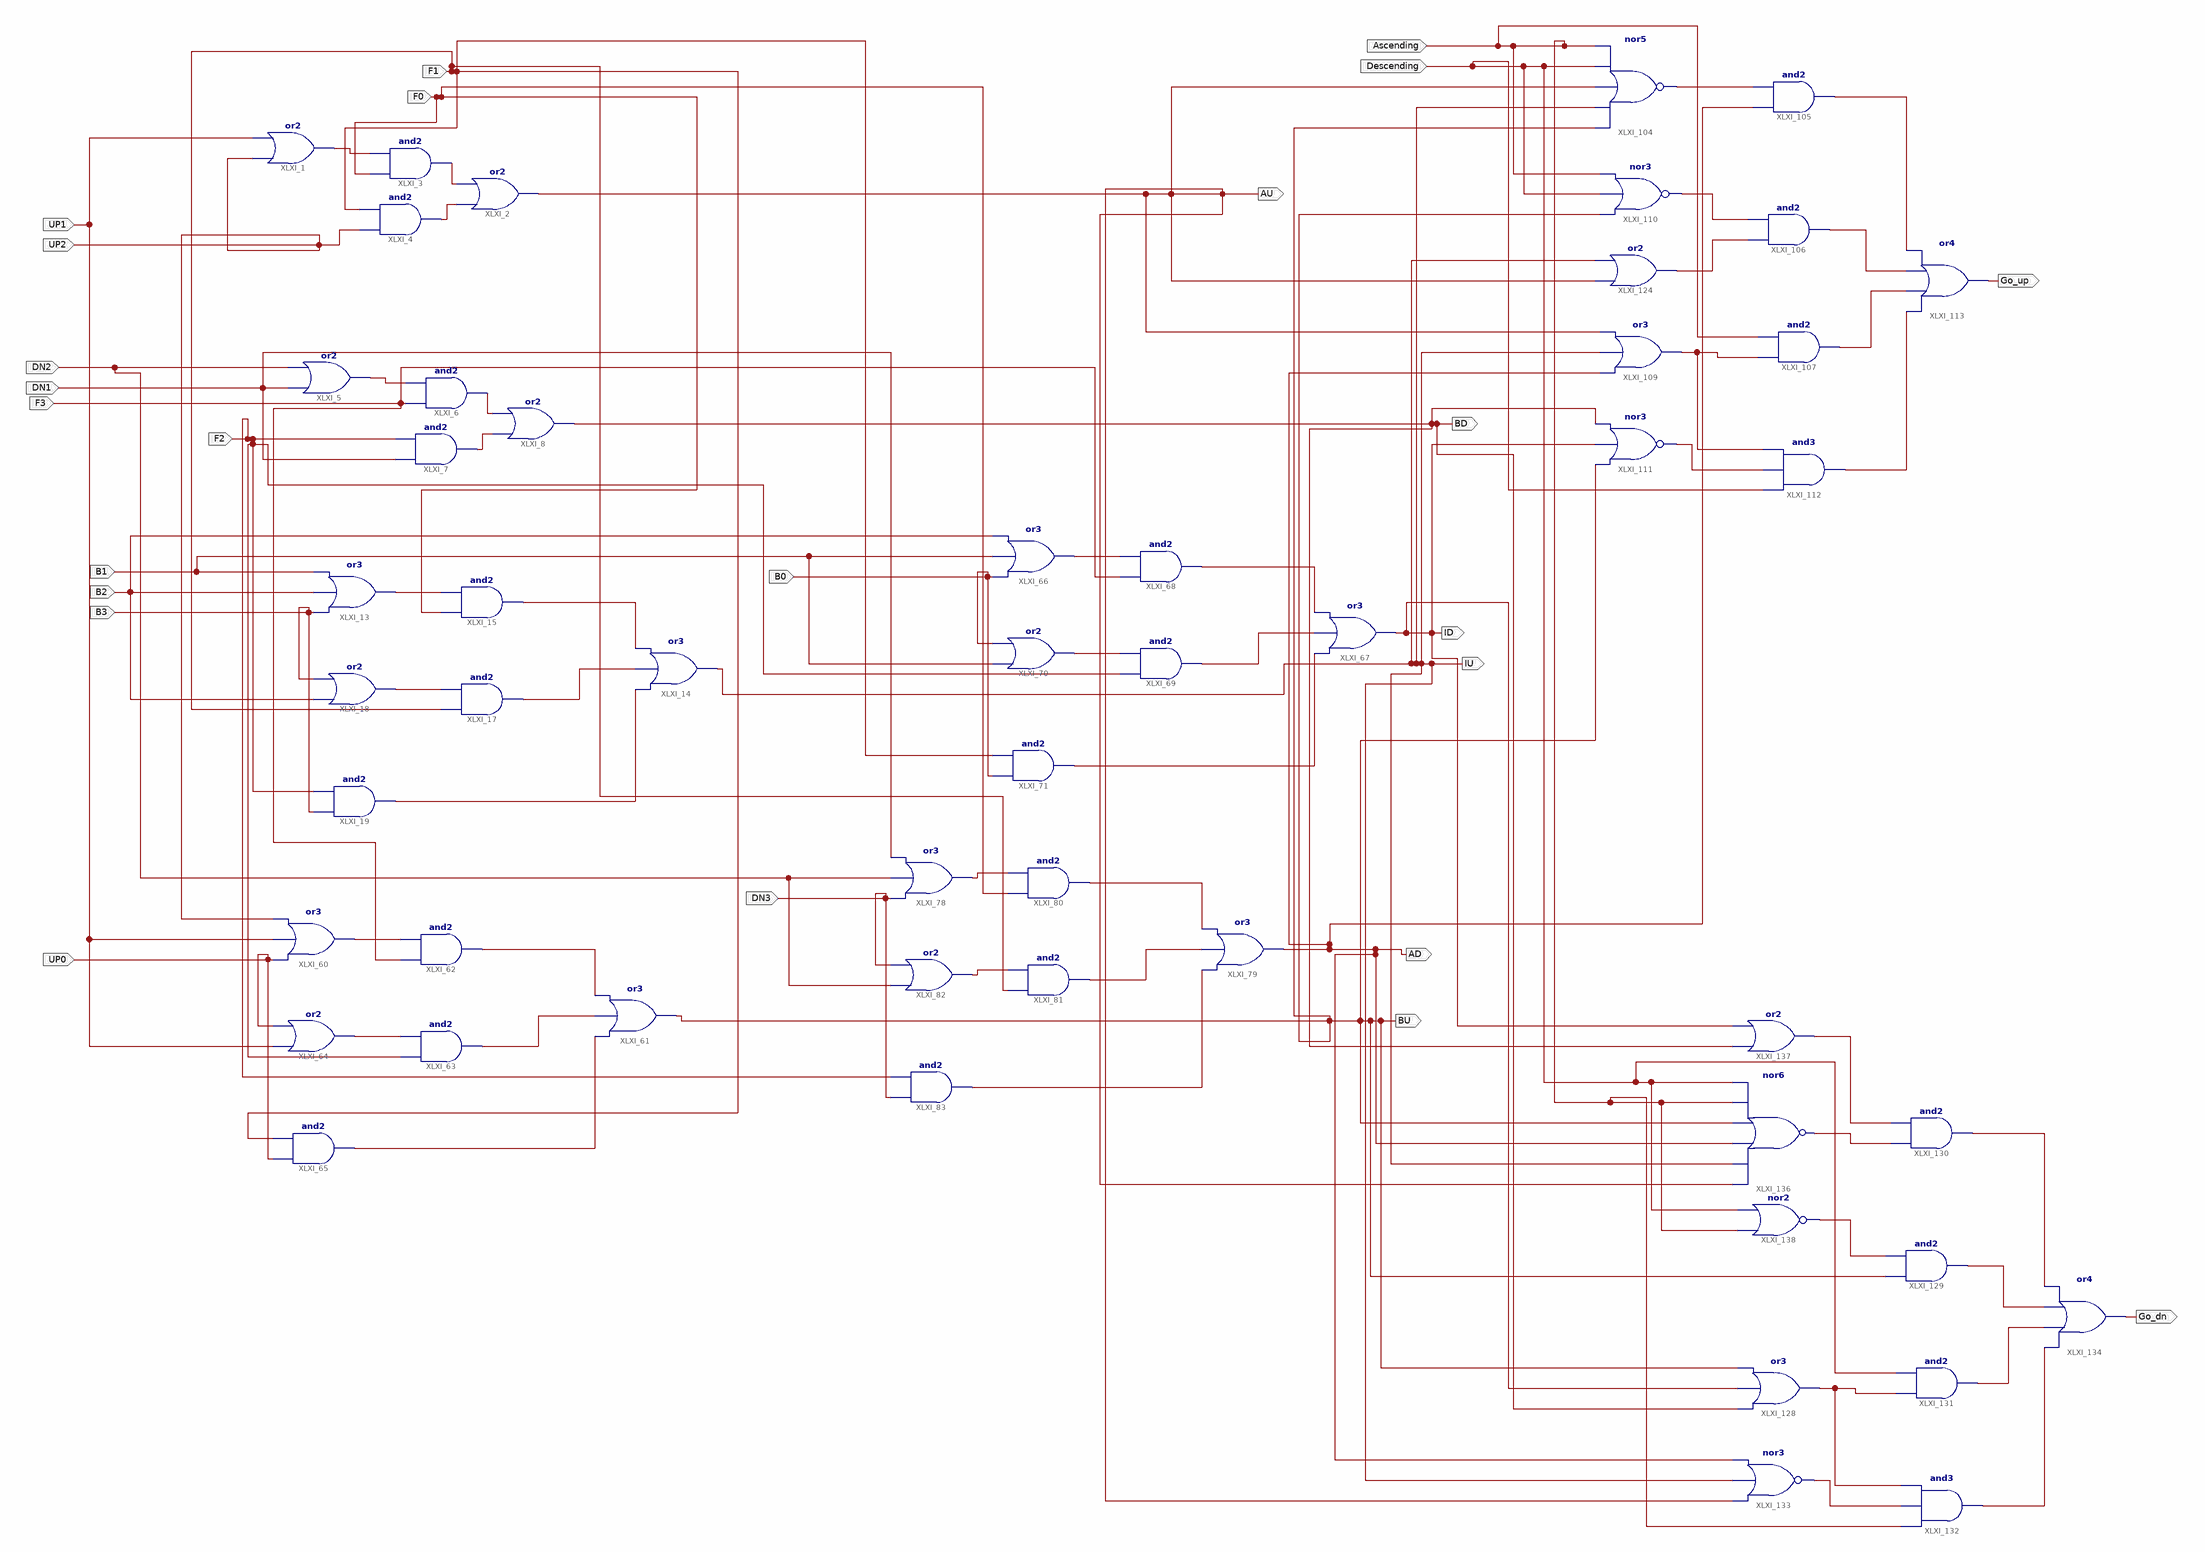
[diagram p0: schematic sheet 1]
// Xilinx ISE schematic 2018cs10385_2018cs10485.sch (spartan6) as structural Verilog: 52 symbols, 24 ports
module \2018cs10385_2018cs10485  (
  input  UP1,
  input  F0,
  input  F1,
  input  UP2,
  input  DN2,
  input  F3,
  input  DN1,
  input  B1,
  input  B3,
  input  F2,
  input  B2,
  input  UP0,
  input  DN3,
  input  B0,
  input  Ascending,
  input  Descending,
  output AU,
  output BD,
  output BU,
  output IU,
  output ID,
  output AD,
  output Go_up,
  output Go_dn
);

  wire XLXN_1, XLXN_2, XLXN_3, XLXN_14, XLXN_15, XLXN_22, XLXN_44, XLXN_46, XLXN_47, XLXN_48, XLXN_49,
       XLXN_115, XLXN_116, XLXN_117, XLXN_118, XLXN_119, XLXN_128, XLXN_129, XLXN_130, XLXN_131, XLXN_132,
       XLXN_145, XLXN_146, XLXN_147, XLXN_148, XLXN_149, XLXN_191, XLXN_196, XLXN_197, XLXN_200, XLXN_202,
       XLXN_204, XLXN_208, XLXN_209, XLXN_210, XLXN_217, XLXN_218, XLXN_219, XLXN_220, XLXN_221, XLXN_222,
       XLXN_226, XLXN_227, XLXN_229;

  or XLXI_5 (XLXN_14, DN1, DN2);
  and XLXI_6 (XLXN_15, F3, XLXN_14);
  and XLXI_7 (XLXN_22, DN1, F2);
  or XLXI_8 (BD, XLXN_22, XLXN_15);
  or XLXI_13 (XLXN_46, B3, B2, B1);
  or XLXI_14 (IU, XLXN_49, XLXN_48, XLXN_47);
  and XLXI_15 (XLXN_47, F0, XLXN_46);
  and XLXI_17 (XLXN_48, F1, XLXN_44);
  or XLXI_18 (XLXN_44, B2, B3);
  and XLXI_19 (XLXN_49, B3, F2);
  or XLXI_60 (XLXN_116, UP0, UP1, UP2);
  or XLXI_61 (BU, XLXN_119, XLXN_118, XLXN_117);
  and XLXI_62 (XLXN_117, F3, XLXN_116);
  and XLXI_63 (XLXN_118, F2, XLXN_115);
  or XLXI_64 (XLXN_115, UP1, UP0);
  and XLXI_65 (XLXN_119, UP0, F1);
  or XLXI_2 (AU, XLXN_3, XLXN_2);
  and XLXI_4 (XLXN_3, UP2, F1);
  and XLXI_3 (XLXN_2, F0, XLXN_1);
  or XLXI_1 (XLXN_1, UP2, UP1);
  and XLXI_83 (XLXN_149, DN3, F2);
  or XLXI_82 (XLXN_145, DN2, DN3);
  or XLXI_78 (XLXN_146, DN3, DN2, DN1);
  and XLXI_71 (XLXN_132, B0, F1);
  or XLXI_70 (XLXN_128, B1, B0);
  and XLXI_69 (XLXN_131, F2, XLXN_128);
  and XLXI_68 (XLXN_130, F3, XLXN_129);
  or XLXI_67 (ID, XLXN_132, XLXN_131, XLXN_130);
  or XLXI_66 (XLXN_129, B0, B1, B2);
  and XLXI_81 (XLXN_148, F1, XLXN_145);
  and XLXI_80 (XLXN_147, F0, XLXN_146);
  or XLXI_79 (AD, XLXN_149, XLXN_148, XLXN_147);
  nor XLXI_104 (XLXN_191, BU, IU, AU, Descending, Ascending);
  and XLXI_105 (XLXN_204, AD, XLXN_191);
  and XLXI_106 (XLXN_210, XLXN_197, XLXN_196);
  and XLXI_107 (XLXN_209, XLXN_200, Ascending);
  or XLXI_109 (XLXN_200, AD, IU, AU);
  nor XLXI_110 (XLXN_196, BU, Descending, Ascending);
  nor XLXI_111 (XLXN_202, BU, ID, BD);
  and XLXI_112 (XLXN_208, Descending, XLXN_202, XLXN_200);
  or XLXI_113 (Go_up, XLXN_208, XLXN_209, XLXN_210, XLXN_204);
  or XLXI_124 (XLXN_197, AU, IU);
  or XLXI_128 (XLXN_217, BD, ID, BU);
  and XLXI_129 (XLXN_222, BU, XLXN_229);
  and XLXI_130 (XLXN_219, XLXN_226, XLXN_227);
  and XLXI_131 (XLXN_221, XLXN_217, Descending);
  and XLXI_132 (XLXN_220, Ascending, XLXN_218, XLXN_217);
  nor XLXI_133 (XLXN_218, AU, IU, AD);
  or XLXI_134 (Go_dn, XLXN_220, XLXN_221, XLXN_222, XLXN_219);
  nor XLXI_136 (XLXN_226, AU, IU, AD, BU, Ascending, Descending);
  or XLXI_137 (XLXN_227, BD, ID);
  nor XLXI_138 (XLXN_229, Ascending, Descending);
endmodule
